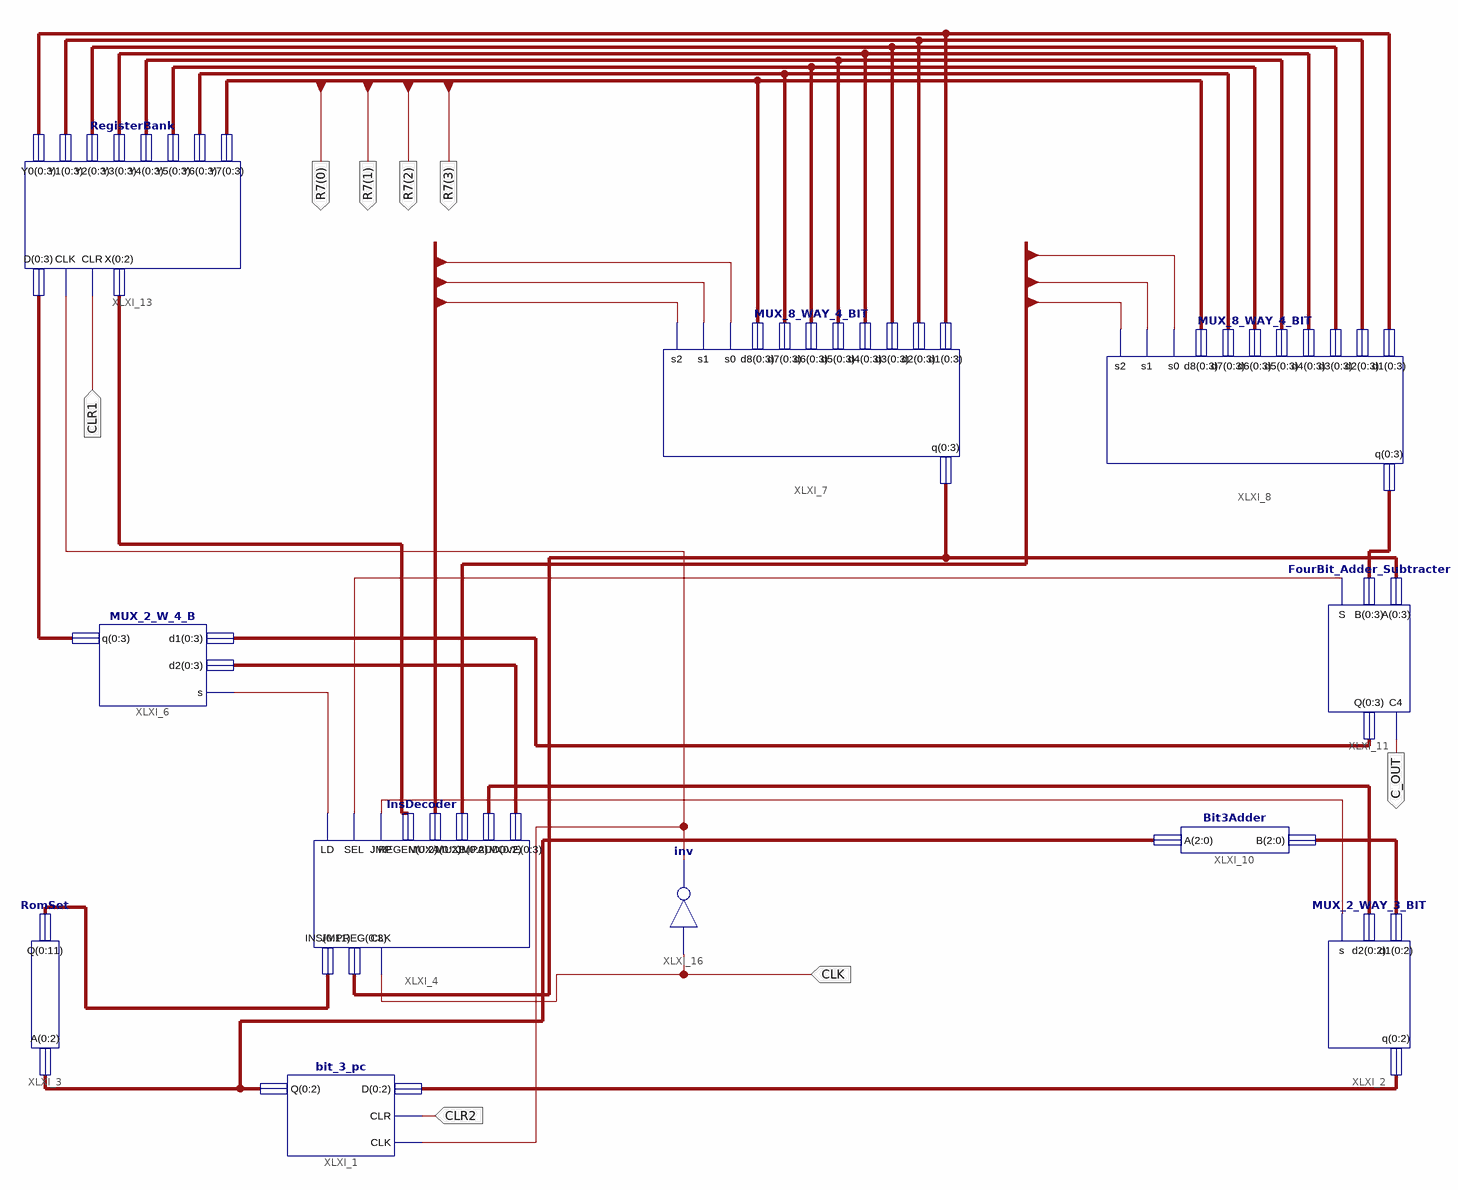
[diagram p0: schematic sheet 1]
// Xilinx ISE schematic Microprocessor.sch (spartan3e) as structural Verilog: 11 symbols, 8 ports
module Microprocessor (
  input  CLR1,
  input  CLR2,
  input  CLK,
  output [3:0] R7,
  output C_OUT
);

  wire XLXN_9, XLXN_14, XLXN_25, XLXN_118;
  wire [2:0] MUXA, MUXB, XLXN_26, XLXN_96, XLXN_99, XLXN_100, XLXN_101;
  wire [3:0] XLXN_10, XLXN_86, XLXN_87, XLXN_90, XLXN_91, XLXN_92, XLXN_93, XLXN_94, XLXN_98, XLXN_103,
       XLXN_104, XLXN_105;
  wire [11:0] XLXN_4;

  bit_3_pc XLXI_1 (
    .D({XLXN_100[0], XLXN_100[1], XLXN_100[2]}), .CLR(CLR2), .CLK(XLXN_118),
    .Q({XLXN_99[0], XLXN_99[1], XLXN_99[2]}));
  MUX_2_WAY_3_BIT XLXI_2 (
    .d1({XLXN_101[0], XLXN_101[1], XLXN_101[2]}), .d2({XLXN_26[0], XLXN_26[1], XLXN_26[2]}),
    .q({XLXN_100[0], XLXN_100[1], XLXN_100[2]}), .s(XLXN_25));
  RomSet XLXI_3 (
    .A({XLXN_99[0], XLXN_99[1], XLXN_99[2]}),
    .Q({XLXN_4[0], XLXN_4[1], XLXN_4[2], XLXN_4[3], XLXN_4[4], XLXN_4[5], XLXN_4[6], XLXN_4[7], XLXN_4[8], XLXN_4[9], XLXN_4[10], XLXN_4[11]}));
  InsDecoder XLXI_4 (
    .CLK(CLK),
    .INS({XLXN_4[0], XLXN_4[1], XLXN_4[2], XLXN_4[3], XLXN_4[4], XLXN_4[5], XLXN_4[6], XLXN_4[7], XLXN_4[8], XLXN_4[9], XLXN_4[10], XLXN_4[11]}),
    .JMP(XLXN_25), .JMPADD({XLXN_26[0], XLXN_26[1], XLXN_26[2]}), .JMPREG(XLXN_103), .LD(XLXN_9),
    .MOVE({XLXN_10[0], XLXN_10[1], XLXN_10[2], XLXN_10[3]}), .MUXA({MUXA[0], MUXA[1], MUXA[2]}),
    .MUXB({MUXB[0], MUXB[1], MUXB[2]}), .REGEN({XLXN_96[0], XLXN_96[1], XLXN_96[2]}), .SEL(XLXN_14));
  MUX_2_W_4_B XLXI_6 (
    .d1({XLXN_105[0], XLXN_105[1], XLXN_105[2], XLXN_105[3]}),
    .d2({XLXN_10[0], XLXN_10[1], XLXN_10[2], XLXN_10[3]}),
    .q({XLXN_98[0], XLXN_98[1], XLXN_98[2], XLXN_98[3]}), .s(XLXN_9));
  MUX_8_WAY_4_BIT XLXI_7 (
    .d4({XLXN_91[0], XLXN_91[1], XLXN_91[2], XLXN_91[3]}),
    .d5({XLXN_92[0], XLXN_92[1], XLXN_92[2], XLXN_92[3]}),
    .d3({XLXN_90[0], XLXN_90[1], XLXN_90[2], XLXN_90[3]}),
    .d1({XLXN_86[0], XLXN_86[1], XLXN_86[2], XLXN_86[3]}),
    .d7({XLXN_94[0], XLXN_94[1], XLXN_94[2], XLXN_94[3]}), .d8({R7[0], R7[1], R7[2], R7[3]}),
    .d2({XLXN_87[0], XLXN_87[1], XLXN_87[2], XLXN_87[3]}),
    .d6({XLXN_93[0], XLXN_93[1], XLXN_93[2], XLXN_93[3]}), .s2(MUXA[0]), .s1(MUXA[1]), .s0(MUXA[2]),
    .q(XLXN_103));
  MUX_8_WAY_4_BIT XLXI_8 (
    .d4({XLXN_91[0], XLXN_91[1], XLXN_91[2], XLXN_91[3]}),
    .d5({XLXN_92[0], XLXN_92[1], XLXN_92[2], XLXN_92[3]}),
    .d3({XLXN_90[0], XLXN_90[1], XLXN_90[2], XLXN_90[3]}),
    .d1({XLXN_86[0], XLXN_86[1], XLXN_86[2], XLXN_86[3]}),
    .d7({XLXN_94[0], XLXN_94[1], XLXN_94[2], XLXN_94[3]}), .d8({R7[0], R7[1], R7[2], R7[3]}),
    .d2({XLXN_87[0], XLXN_87[1], XLXN_87[2], XLXN_87[3]}),
    .d6({XLXN_93[0], XLXN_93[1], XLXN_93[2], XLXN_93[3]}), .s2(MUXB[0]), .s1(MUXB[1]), .s0(MUXB[2]),
    .q(XLXN_104));
  Bit3Adder XLXI_10 (.A({XLXN_99[0], XLXN_99[1], XLXN_99[2]}), .B({XLXN_101[0], XLXN_101[1], XLXN_101[2]}));
  FourBit_Adder_Subtracter XLXI_11 (
    .A(XLXN_103), .B(XLXN_104), .C4(C_OUT), .Q({XLXN_105[0], XLXN_105[1], XLXN_105[2], XLXN_105[3]}),
    .S(XLXN_14));
  RegisterBank XLXI_13 (
    .CLK(XLXN_118), .CLR(CLR1), .D({XLXN_98[0], XLXN_98[1], XLXN_98[2], XLXN_98[3]}),
    .X({XLXN_96[0], XLXN_96[1], XLXN_96[2]}), .Y0({XLXN_86[0], XLXN_86[1], XLXN_86[2], XLXN_86[3]}),
    .Y1({XLXN_87[0], XLXN_87[1], XLXN_87[2], XLXN_87[3]}),
    .Y2({XLXN_90[0], XLXN_90[1], XLXN_90[2], XLXN_90[3]}),
    .Y3({XLXN_91[0], XLXN_91[1], XLXN_91[2], XLXN_91[3]}),
    .Y4({XLXN_92[0], XLXN_92[1], XLXN_92[2], XLXN_92[3]}),
    .Y5({XLXN_93[0], XLXN_93[1], XLXN_93[2], XLXN_93[3]}),
    .Y6({XLXN_94[0], XLXN_94[1], XLXN_94[2], XLXN_94[3]}), .Y7({R7[0], R7[1], R7[2], R7[3]}));
  not XLXI_16 (XLXN_118, CLK);
endmodule
